# Altium schematic sheet MAIN.SchDoc
size A
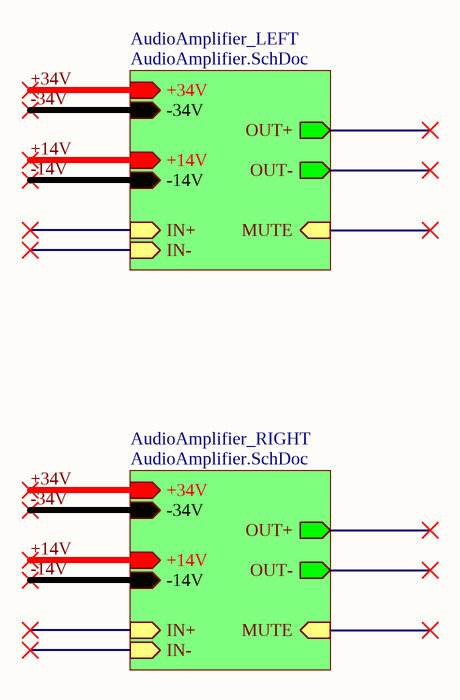
[diagram p0: MAIN.SchDoc]

## Sub-sheets
AudioAmplifier_LEFT = AudioAmplifier.SchDoc: IN+ (in), IN- (in), +14V (in), -14V (in), +34V (in), -34V (in), OUT+ (out), OUT- (out), MUTE (in)
AudioAmplifier_RIGHT = AudioAmplifier.SchDoc: IN+ (in), IN- (in), +14V (in), -14V (in), +34V (in), -34V (in), OUT+ (out), OUT- (out), MUTE (in)

## Nets
+14V: sheet AudioAmplifier_LEFT/+14V, sheet AudioAmplifier_RIGHT/+14V
+34V: sheet AudioAmplifier_LEFT/+34V, sheet AudioAmplifier_RIGHT/+34V
-14V: sheet AudioAmplifier_LEFT/-14V, sheet AudioAmplifier_RIGHT/-14V
-34V: sheet AudioAmplifier_LEFT/-34V, sheet AudioAmplifier_RIGHT/-34V